# Altium schematic sheet FADE.SchDoc
size A; SheetNumber: 1; SheetTotal: 4
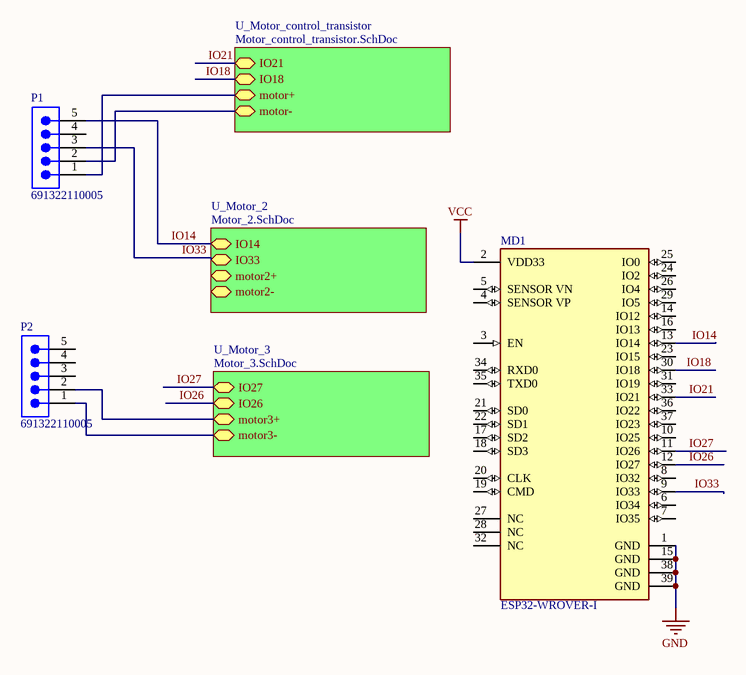
[diagram p0: FADE.SchDoc]

## Parts
MD1  ESP32-WROVER-I  [FP-ESP32-WROVER-I-MFG]
P1  691322110005  [691322110005]
P2  691322110005  [691322110005]

## Sub-sheets
U_Motor_2 = Motor_2.SchDoc: IO14 (bidir), IO33 (bidir), motor2+ (bidir), motor2- (bidir)
U_Motor_3 = Motor_3.SchDoc: IO27 (bidir), IO26 (bidir), motor3+ (bidir), motor3- (bidir)
U_Motor_control_transistor = Motor_control_transistor.SchDoc: IO21 (bidir), IO18 (bidir), motor+ (bidir), motor- (bidir)

## Nets
GND: MD1.1(GND) MD1.15(GND) MD1.38(GND) MD1.39(GND)
VCC: MD1.2(VDD33)
IO14: MD1.13(IO14) P1.5 ; sheet U_Motor_2/IO14
IO18: MD1.30(IO18) ; sheet U_Motor_control_transistor/IO18
IO21: MD1.33(IO21) ; sheet U_Motor_control_transistor/IO21
IO26: MD1.12(IO27) ; sheet U_Motor_3/IO26
IO27: MD1.11(IO26) ; sheet U_Motor_3/IO27
IO33: MD1.9(IO33) P1.3 ; sheet U_Motor_2/IO33
NetP1_1: P1.1 ; sheet U_Motor_control_transistor/motor+
NetP1_2: P1.2 ; sheet U_Motor_control_transistor/motor-
NetP2_1: P2.1 ; sheet U_Motor_3/motor3-
NetP2_2: P2.2 ; sheet U_Motor_3/motor3+

Not connected (* = marked no-connect by the designer): MD1 3(EN) 4(SENSOR_VP) 5(SENSOR_VN) 6(IO34) 7(IO35) 8(IO32) 10(IO25) 14(IO12) 16(IO13) 17(SD2) 18(SD3) 19(CMD) 20(CLK) 21(SD0) 22(SD1) 23(IO15) 24(IO2) 25(IO0) 26(IO4) 27(NC) 28(NC) 29(IO5) 31(IO19) 32(NC) 34(RXD0) 35(TXD0) 36(IO22) 37(IO23); P1 4; P2 3 4 5

## Library data of the parts
MD1 = CMP-194065-000001-1: SMD MODULE, ESP32-D0WDQ6, 32MBIT; Manufacturer: Espressif; Number Of Adc Channels: 16; Min Supply Voltage: 2.3V; Interface: I2C,SPI,UART,I2S,Other; Max Frequency: 2484MHz; Nominal Supply Current: 500mA; Sensitivity: -98dBm; Max Supply Voltage: 3.6V; Number Of Gpio: 20; Data Rate: 150Mbits/s; Package: ESP32-WROVER-I; Temperature Range Low: -40°C; Temperature Range High: +85°C; Device Class L1: Integrated Circuits (ICs); Category: UNK; ComponentLink2Description: Datasheet; Device Class L2: RF Semiconductors and Devices; Automotive: No; Lead Free: Yes; Octopart: https://octopart.com/esp32-wrover-i-espressif+systems-89171349; ComponentLink2URL: https://www.espressif.com/sites/default/files/documentation/esp32-wrover_datasheet_en.pdf; Temperature: -40°C to +85°C; Height: 3.4mm; RoHS: TRUE; Digikey Description: SMD MODULE, ESP32-D0WDQ6, 32MBIT; Device Class L3: Transceivers; Manufacturer Part Number: ESP32-WROVER-I
P1 P2 = CMP-1502-01794-2: NexarPartId: 18818349; Pitch: 3.5052mm; Current: 10A; Gender: Male; Number of Contacts: 5; Voltage: 300V; Number of Levels: 1; REACH SVHC: Unknown; Number of Rows: 1; Mount: Through Hole; Termination: Solder; Packaging: Box; Lead Pitch: 3.5mm; Contact Gender: Male; Number of Pins: 5; Contact Material: Brass; RoHS: Compliant; Color: Green; Length: 10.5mm; Width: 18.6mm; Number of Positions Per Level: 5; Height: 9.2mm